# EAGLE design eeZeeISP3 (EAGLE 6.4)
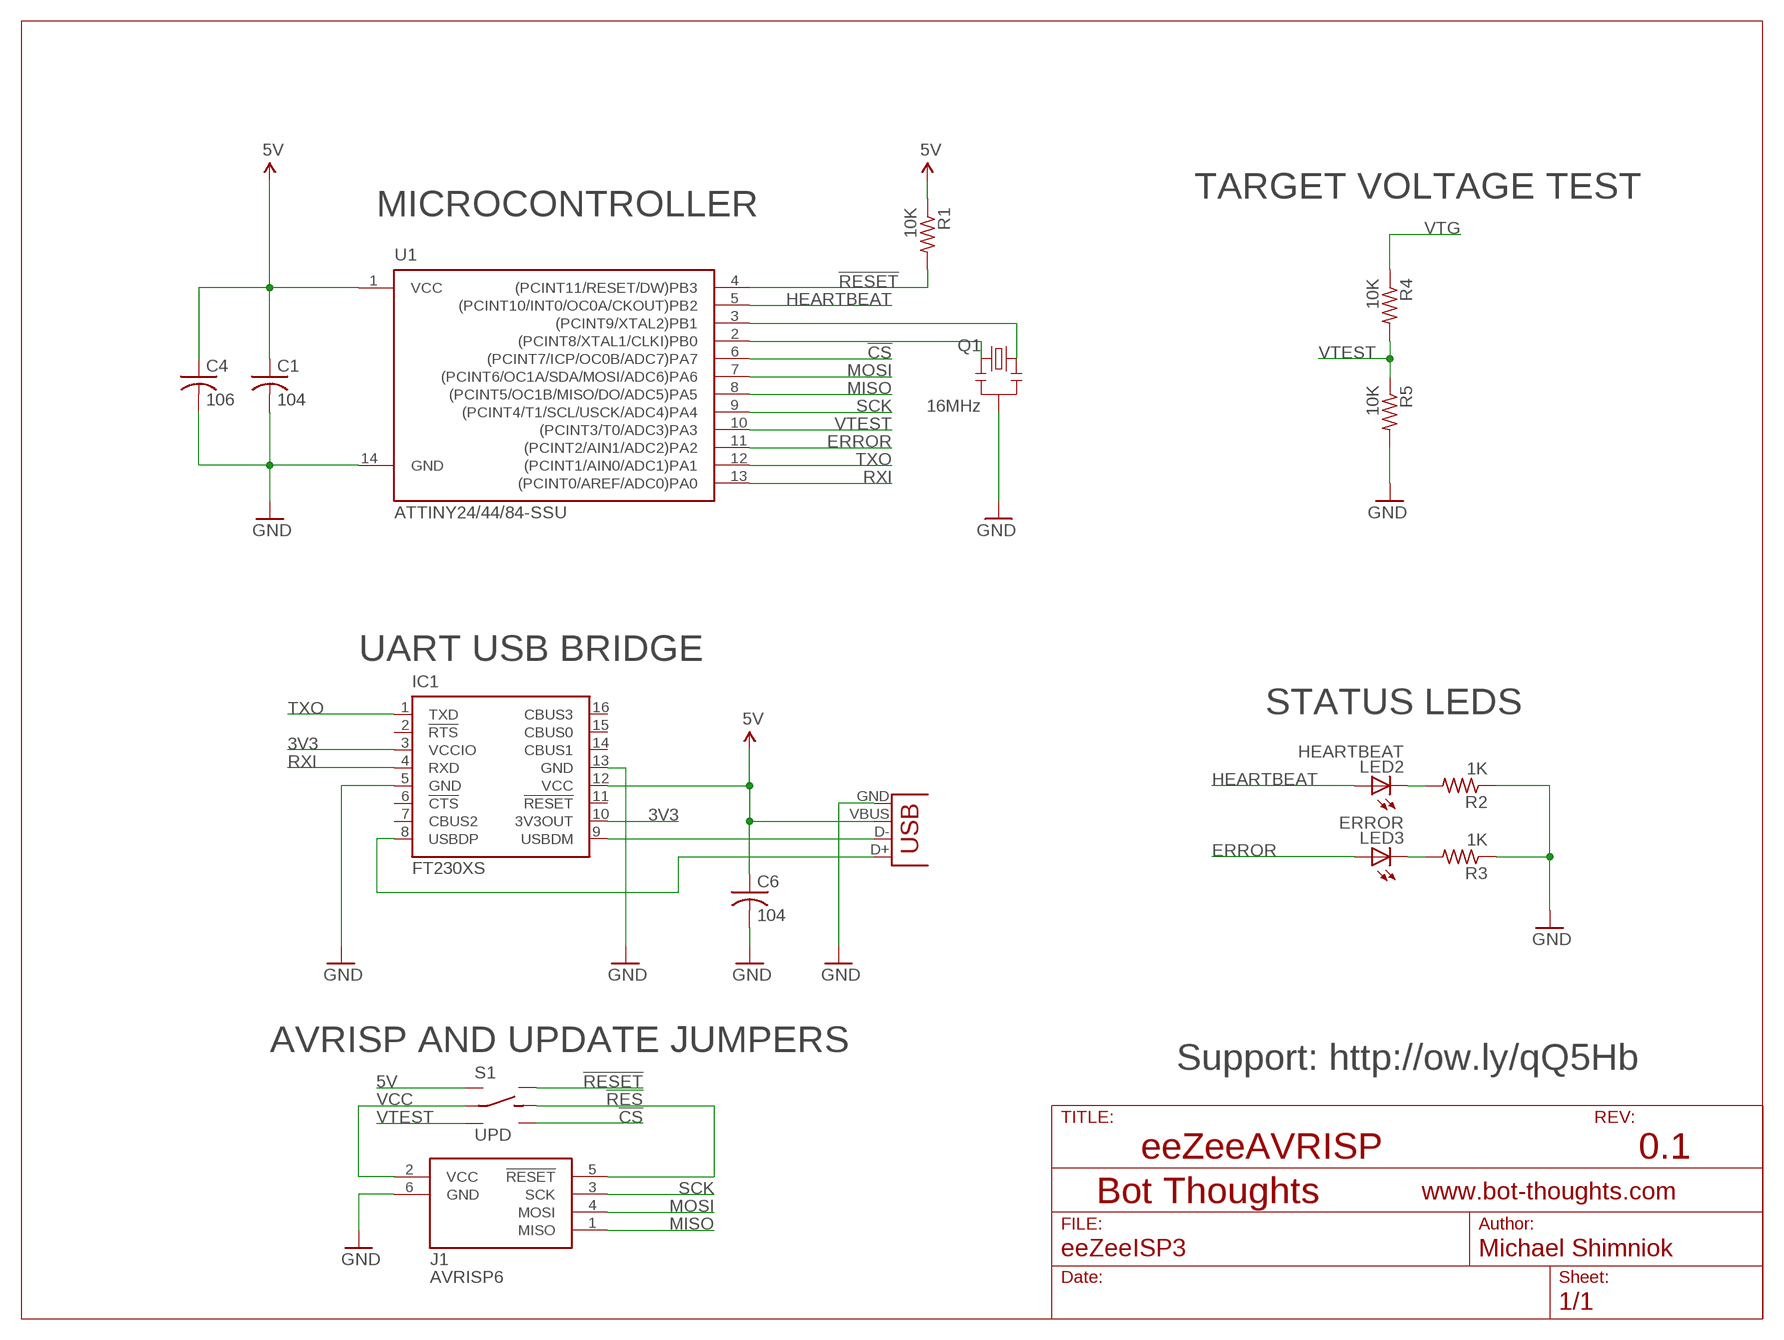
[diagram p0: schematic, sheet 1]

## Parts
C1  104  C-USC0603  [C0603]
C4  106  C-USC0603  [C0603]
C6  104  C-USC0603  [C0603]
IC1  FT230XS  [SSOP16]
J1  AVRISP6  [CON6P2R]
LED2  HEARTBEAT  LEDCHIPLED_1206  [CHIPLED_1206]
LED3  ERROR  LEDCHIPLED_1206  [CHIPLED_1206]
Q1  16MHz  RESONATOR_CSTCE_V_C  [CSTCE_V_C]
R1  10K  R-US_R0603  [R0603]
R2  1K  R-US_R0603  [R0603]
R3  1K  R-US_R0603  [R0603]
R4  10K  R-US_R0603  [R0603]
R5  10K  R-US_R0603  [R0603]
S1  UPD  DPDT_JS202011CQN  [DPDT_JS202011CQN]
U1  ATTINY24/44/84-SSU  [SOIC14]
X2  USB-SMD-NS  [USB-MINIB-NOSTOP]

## Nets
3V3: IC1.3(VCCIO) IC1.10(3V3OUT)
5V: C1.1 C4.1 C6.1 IC1.12(VCC) R1.1 S1.1(L1) U1.1(VCC) X2.VBUS
!CS: S1.6(R2) U1.6((PCINT7/ICP/OC0B/ADC7)PA7)
!RES: J1.5(!RESET) S1.5(RC)
!RESET: R1.2 S1.4(R1) U1.4((PCINT11/RESET/DW)PB3)
ERROR: LED3.A U1.11((PCINT2/AIN1/ADC2)PA2)
GND: C1.2 C4.2 C6.2 IC1.5(GND) IC1.13(GND) J1.6(GND) Q1.GND R2.1 R3.1 R5.2 U1.14(GND) X2.GND
HEARTBEAT: LED2.A U1.5((PCINT10/INT0/OC0A/CKOUT)PB2)
MISO: J1.1(MISO) U1.8((PCINT5/OC1B/MISO/DO/ADC5)PA5)
MOSI: J1.4(MOSI) U1.7((PCINT6/OC1A/SDA/MOSI/ADC6)PA6)
N$8: Q1.X1 U1.3((PCINT9/XTAL2)PB1)
N$9: IC1.8(USBDP) X2.D+
N$10: LED2.C R2.2
N$11: LED3.C R3.2
N$13: Q1.X2 U1.2((PCINT8/XTAL1/CLKI)PB0)
N$15: IC1.9(USBDM) X2.D-
RXI: IC1.4(RXD) U1.13((PCINT0/AREF/ADC0)PA0)
SCK: J1.3(SCK) U1.9((PCINT4/T1/SCL/USCK/ADC4)PA4)
TXO: IC1.1(TXD) U1.12((PCINT1/AIN0/ADC1)PA1)
VCC: J1.2(VCC) S1.2(LC)
VTEST: R4.2 R5.1 S1.3(L2) U1.10((PCINT3/T0/ADC3)PA3)
VTG: R4.1
Unconnected: IC1.2(!RTS) IC1.6(!CTS) IC1.7(CBUS2) IC1.11(!RESET) IC1.14(CBUS1) IC1.15(CBUS0) IC1.16(CBUS3)

## Notes on the sheet
- TARGET VOLTAGE TEST
- MICROCONTROLLER
- UART USB BRIDGE
- STATUS LEDS
- AVRISP AND UPDATE JUMPERS
- Support: http://ow.ly/qQ5Hb
- eeZeeAVRISP | 0.1

## Library data of the parts
C1 C4 C6 = rcl:C-US: CAPACITOR, American symbol
IC1 = ftdichip:FT230X: USB to BASIC UART IC Auto generated by make-symbol-device-package-bsdl.ulp Rev. 43 Source: Data sheet <http://www.ftdichip.com/Support/Documents/DataSheets/ICs/DS_FT230X.pdf>
J1 = bt_avr:AVRISP6: 6-pin dual-row connector for Atmel AVRISP programmer interface
LED2 LED3 = bt_opto:LED: LED Various packages
Q1 = bt_crystal:RESONATOR: Crystal Resonator, 3-pin
R1-R5 = rcl:R-US_: RESISTOR, American symbol
S1 = bt_electromech:DPDT: Dual Position, Dual Throw (DPDT) Switch
U1 = bt_avr:ATTINY24/44/84: Atmel AVR ATtiny24/44/84 14-pin High Performance, Low Power AVR® 8-bit Microcontroller
X2 = SparkFun:USB: USB Connectors USB-B-PTH is fully proven SKU : PRT-00139 USB-miniB is fully proven SKU : PRT-00587 USB-A-PCB is untested. USB-A-H is throughly reviewed, but untested. Spark Fun Electronics SKU : PRT-00437 USB-B-SMT is throughly reviewed, but untested. Needs silkscreen touching up. USB-A-S has not been used/tested USB-MB-H has not been used/tested

## Net classes
1 power: width 0.254 mm

## Board
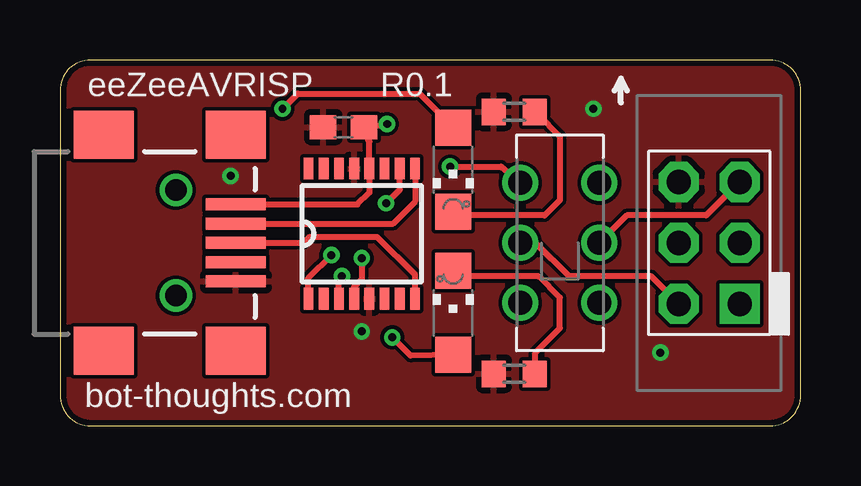
[diagram p1: board, top side]
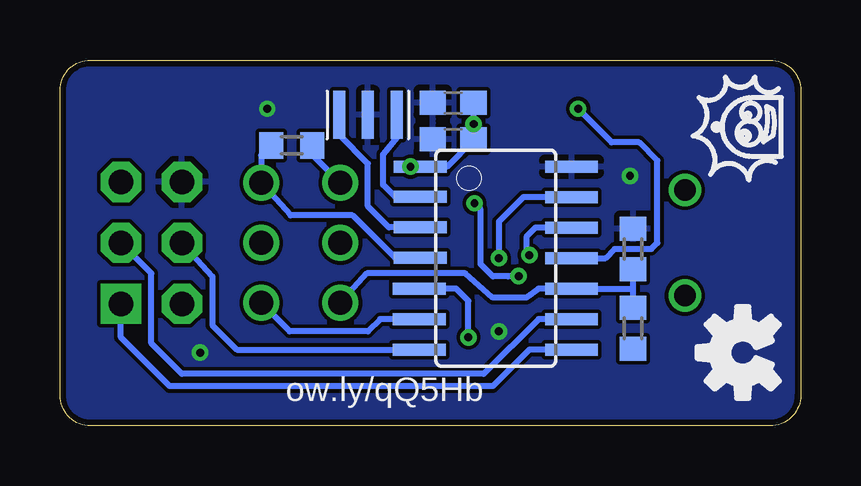
[diagram p2: board, bottom side, seen from below]

Size 30.86 x 15.24 mm. Coordinates in mm from the lower left corner, seen from the top.
Outline: 0,13.97 0,1.27 arc90 1.27,0 29.59,0 arc90 30.86,1.27 30.86,13.97 arc90 29.59,15.24 1.27,15.24 arc90 0,13.97
Copper layers (1*16): Top 0.0356mm / dielectric 1.5011mm / Bottom 0.0356mm
Design rules "LaenPCBOrder *": minimum track width 6mil, minimum drill 13mil, track to track 6mil, track to pad 6mil, pad to pad 6mil, via to via 6mil, smd to smd 6mil, copper to edge 10mil, drill to drill 6mil, minimum pad ring 7mil, minimum via ring 7mil, stop-mask expansion 4mil, vias tented up to drill 20mil, thermal gap 10mil

### Footprints (pad centres in the part's own frame; a part is rotated, then mirrored left to right if it is on the bottom)
C0603 = smd 1.1 x 1: 1 -0.85,0; 2 0.85,0
SSOP16 = smd 0.914 x 0.406: 1 -2.718,2.223; 2 -2.718,1.587; 3 -2.718,0.953; 4 -2.718,0.318; 5 -2.718,-0.318; 6 -2.718,-0.953; 7 -2.718,-1.587; 8 -2.718,-2.223; 9 2.718,-2.223; 10 2.718,-1.587; 11 2.718,-0.953; 12 2.718,-0.318; 13 2.718,0.318; 14 2.718,0.953; 15 2.718,1.587; 16 2.718,2.223
CON6P2R = drill 1.016 pad 1.676 square: 1 -2.54,-1.27 | drill 1.016 pad 1.676 octagon: 2 -2.54,1.27; 3 0,-1.27; 4 0,1.27; 5 2.54,-1.27; 6 2.54,1.27
CHIPLED_1206 = smd 1.5 x 1.5: A 0,-1.75; C 0,1.75
CSTCE_V_C = smd 0.5 x 2: GND 0,0; X1 -1.2,0; X2 1.2,0
R0603 = smd 1 x 1.1: 1 -0.85,0; 2 0.85,0
DPDT_JS202011CQN = drill 1: 1 -2.5,-1.65; 2 0,-1.651; 3 2.5,-1.65; 4 -2.5,1.65; 5 0,1.651; 6 2.5,1.65
SOIC14 = smd 0.5 x 2.2: 1 -1.905,-3.154; 2 -0.645,-3.154; 3 0.625,-3.154; 4 1.895,-3.154; 5 3.175,-3.196; 6 4.445,-3.196; 7 5.715,-3.196; 8 5.715,3.154; 9 4.445,3.154; 10 3.175,3.154; 11 1.905,3.154; 12 0.635,3.154; 13 -0.635,3.154; 14 -1.905,3.154
USB-MINIB-NOSTOP = smd 2.5 x 0.5: D+ 2.5,0; D- 2.5,0.8; GND 2.5,-1.6; ID 2.5,-0.8; VBUS 2.5,1.6 | smd 2.5 x 2: G1 -3,-4.5; G2 -3,4.5; G3 2.5,4.5; G4 2.5,-4.5 | drill 0.9 pad 0.8: H1 0,2.2 | drill 0.9 pad 0.787: H2 0,-2.2

### Placement (x,y rotation side)
C1  14.48,11.94 180 bottom
C4  14.48,13.46 180 bottom
C6  11.81,12.45 180 top
IC1  12.57,8 90 top
J1  27.05,7.62 90 top
LED2  16.38,4.7 0 top
LED3  16.38,10.67 180 top
Q1  18.03,12.95 0 bottom
R1  21.21,11.68 180 bottom
R2  18.92,2.16 0 top
R3  18.92,13.08 0 top
R4  6.99,4.06 90 bottom
R5  6.99,7.37 90 bottom
S1  20.83,7.62 270 top
U1  12.7,8.89 270 bottom
X2  4.83,7.62 0 top

### Tracks (layer width: path | path; a pad name or v marks a point on that pad's centre or on a via)
3V3  (via drill 0.33)
  Top 0.254: IC1.3 11.61,6.12 v11.75,6.24 | v13.59,9.27 14.16,9.84 IC1.10
  Bottom 0.254: v11.75,6.24 12.19,6.22 12.83,6.22 13.34,6.73 13.34,9.02 v13.59,9.27
5V  (via drill 0.33)
  Top 0.254: X2.VBUS 12.39,9.22 12.89,9.72 IC1.12 12.89,11.84 C6.1 v13.63,12.57 | v16.26,10.79 18.38,10.79 S1.1
  Bottom 0.254: C1.1 14.19,11.34 14.73,10.79 U1.1 v16.26,10.79 | C1.1 13.63,12.15 | C4.1 v13.63,12.57 C1.1 | R1.1 20.36,11.3 S1.1
!CS
  Bottom 0.254: U1.6 17.53,4.45 18.03,3.94 21.3,3.94 S1.6
!RES
  Top 0.254: J1.5 26.92,8.76 23.62,8.76 S1.5
!RESET
  Bottom 0.254: U1.4 16.9,7 18.67,8.76 21.25,8.76 S1.4 22.48,11.27 R1.2
ERROR  (via drill 0.33)
  Top 0.254: v9.27,13.21 9.91,13.84 14.99,13.84 16.38,12.45 LED3.A
  Bottom 0.254: U1.11 8.13,6.99 7.75,7.37 6.22,7.37 5.97,7.62 5.97,11.05 6.73,11.81 7.87,11.81 v9.27,13.21
GND  (via drill 0.33)
  other vias: 7.11,10.41 12.57,3.94 25.02,3.05 22.23,13.21
  pour Top: 29.59,0 1.27,0 arc-90 0,1.27 0,13.97 arc-90 1.27,15.24 29.59,15.24 arc-90 30.86,13.97 30.86,1.27 arc-90
  pour Bottom: 29.59,0 1.27,0 arc-90 0,1.27 0,13.97 arc-90 1.27,15.24 29.59,15.24 arc-90 30.86,13.97 30.86,1.27 arc-90
HEARTBEAT  (via drill 0.33)
  Top 0.254: LED2.A 14.61,2.92 v13.84,3.68
  Bottom 0.254: v13.84,3.68 13.84,5.21 14.35,5.71 U1.5
MISO
  Bottom 0.254: U1.8 11.3,3.17 12.83,1.65 26.29,1.65 28.32,3.68 J1.1
MOSI
  Bottom 0.254: J1.4 24.51,6.22 24.51,4.19 23.5,3.17 U1.7
N$8
  Bottom 0.254: U1.3 17.16,8.27 18.03,9.14 18.03,10.92 19.23,12.12 Q1.X1
N$9
  Top 0.254: X2.D+ 10.16,7.62 10.41,7.87 13.21,7.87 14.8,6.29 IC1.8
N$10
  Top 0.254: R2.2 19.81,3.05 20.83,4.06 20.83,5.33 19.94,6.22 16.61,6.22 LED2.C
N$11
  Top 0.254: R3.2 19.9,12.99 20.83,12.06 20.83,9.4 20.19,8.76 16.54,8.76 LED3.C
N$13
  Bottom 0.254: U1.2 16.9,9.54 17.4,10.03 17.4,11.3 16.83,11.99 Q1.X2
N$15
  Top 0.254: IC1.9 14.8,9.34 13.88,8.42 X2.D-
RXI  (via drill 0.33)
  Top 0.254: v12.57,6.99 12.57,6.1 12.26,5.78 IC1.4
  Bottom 0.254: U1.13 11.56,9.53 12.57,8.51 v12.57,6.99
SCK
  Bottom 0.254: U1.9 10.92,4.45 13.21,2.16 25.78,2.16 27.05,3.43 27.05,6.35 J1.3
TXO  (via drill 0.33)
  Top 0.254: v11.3,7.11 10.35,6.16 IC1.1
  Bottom 0.254: U1.12 11.05,8.26 11.43,7.87 11.43,7.37 v11.3,7.11
VCC
  Top 0.254: J1.2 24.64,6.22 21.21,6.22 19.81,7.62 S1.2
VTEST
  Bottom 0.254: 6.99,5.71 U1.10 10.92,5.71 11.43,5.33 12.83,5.33 13.97,6.35 18.07,6.35 S1.3 | 6.99,5.71 R5.1 | R4.2 6.99,5.71

### Text on the board
bPlace: ow.ly/qQ5Hb
tNames: eeZeeAVRISP | R0.1 | bot-thoughts.com
tsilk: 106 | 104 | 10K | 10K | !R | 10K | 1K | 1K
bsilk: 104